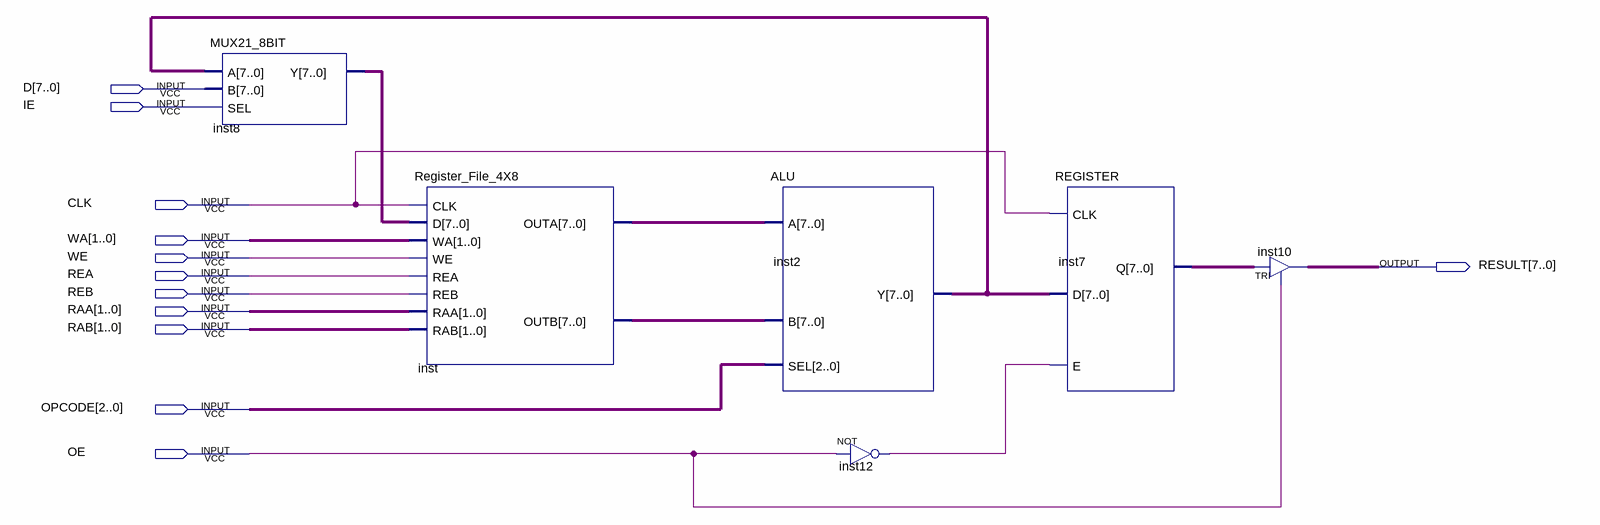
[diagram p0: schematic sheet]
// Quartus schematic Simple_Processor_DATAPATH.bdf as structural Verilog: 6 symbols, 12 pins
module Simple_Processor_DATAPATH (
  input  [7:0] D,
  input  IE,
  input  CLK,
  input  [1:0] WA,
  input  WE,
  input  REA,
  input  REB,
  input  [1:0] RAA,
  input  [1:0] RAB,
  input  [2:0] OPCODE,
  input  OE,
  output [7:0] RESULT
);

  wire inst12_out;
  wire [7:0] inst2_y, inst7_q, inst8_y, inst_outa, inst_outb;

  MUX21_8BIT inst8 (.A(inst2_y), .B(D), .SEL(IE), .Y(inst8_y));
  Register_File_4X8 inst (
    .CLK(CLK), .D(inst8_y), .WA(WA), .WE(WE), .REA(REA), .REB(REB), .RAA(RAA), .RAB(RAB), .OUTA(inst_outa),
    .OUTB(inst_outb));
  ALU inst2 (.A(inst_outa), .B(inst_outb), .SEL(OPCODE), .Y(inst2_y));
  not inst12 (inst12_out, OE);
  REGISTER inst7 (.CLK(CLK), .D(inst2_y), .E(inst12_out), .Q(inst7_q));
  TRI inst10[7:0] (.IN(inst7_q), .OE(OE), .OUT(RESULT));
endmodule
